# EAGLE design LED_board (2) (EAGLE 9.6.2)
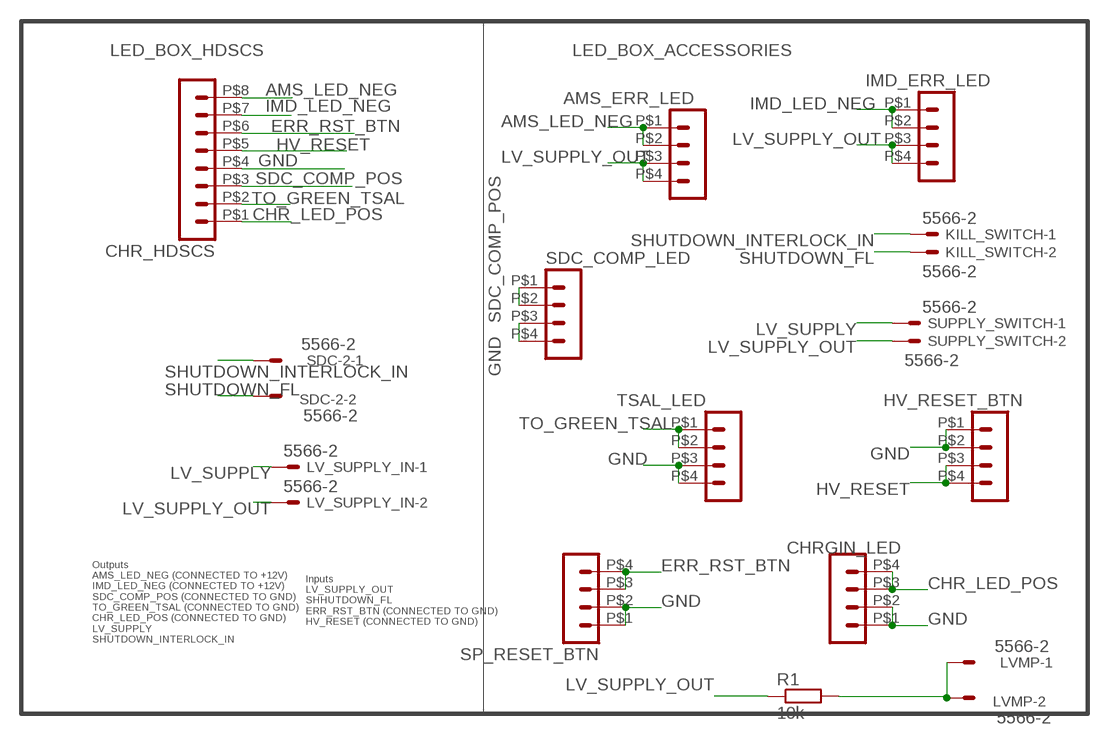
[diagram p0: schematic, sheet 1]

## Parts
AMS_ERR_LED  HEADER_POS4_43045-0412  [43045-0412]
CHR_HDSCS  HEADER_POS8_44914-0801  [44914-0801]
CHRGIN_LED  HEADER_POS4_43045-0412  [43045-0412]
HV_RESET_BTN  HEADER_POS4_43045-0412  [43045-0412]
IMD_ERR_LED  HEADER_POS4_43045-0412  [43045-0412]
KILL_SWITCH  5566-2  [5566-2]
LV_SUPPLY_IN  5566-2  [5566-2]
LVMP  5566-2  [5566-2]
R1  10k  R-EU_M0805  [M0805]
SDC-2  5566-2  [5566-2]
SDC_COMP_LED  HEADER_POS4_44914-0401  [44914-0401]
SP_RESET_BTN  HEADER_POS4_43045-0412  [43045-0412]
SUPPLY_SWITCH  5566-2  [5566-2]
TSAL_LED  HEADER_POS4_43045-0412  [43045-0412]

## Nets
AMS_LED_NEG: AMS_ERR_LED.P$1 AMS_ERR_LED.P$2 CHR_HDSCS.P$8
CHR_LED_POS: CHR_HDSCS.P$1 CHRGIN_LED.P$3 CHRGIN_LED.P$4
ERR_RST_BTN: CHR_HDSCS.P$6 SP_RESET_BTN.P$3 SP_RESET_BTN.P$4
GND: CHR_HDSCS.P$4 CHRGIN_LED.P$1 CHRGIN_LED.P$2 HV_RESET_BTN.P$1 HV_RESET_BTN.P$2 SDC_COMP_LED.P$3 SDC_COMP_LED.P$4 SP_RESET_BTN.P$1 SP_RESET_BTN.P$2 TSAL_LED.P$3 TSAL_LED.P$4
HV_RESET: CHR_HDSCS.P$5 HV_RESET_BTN.P$3 HV_RESET_BTN.P$4
IMD_LED_NEG: CHR_HDSCS.P$7 IMD_ERR_LED.P$1 IMD_ERR_LED.P$2
LV_SUPPLY: LV_SUPPLY_IN.1 SUPPLY_SWITCH.1
LV_SUPPLY_OUT: AMS_ERR_LED.P$3 AMS_ERR_LED.P$4 IMD_ERR_LED.P$3 IMD_ERR_LED.P$4 LV_SUPPLY_IN.2 R1.1 SUPPLY_SWITCH.2
N$1: LVMP.1 LVMP.2 R1.2
SDC_COMP_POS: CHR_HDSCS.P$3 SDC_COMP_LED.P$1 SDC_COMP_LED.P$2
SHUTDOWN_FL: KILL_SWITCH.2 SDC-2.2
SHUTDOWN_INTERLOCK_IN: KILL_SWITCH.1 SDC-2.1
TO_GREEN_TSAL: CHR_HDSCS.P$2 TSAL_LED.P$1 TSAL_LED.P$2

## Notes on the sheet
- LED_BOX_HDSCS | LED_BOX_ACCESSORIES
- Inputs
  LV_SUPPLY_OUT
  SHHUTDOWN_FL
  ERR_RST_BTN (CONNECTED TO GND)
  HV_RESET (CONNECTED TO GND)
- Outputs
  AMS_LED_NEG (CONNECTED TO +12V)
  IMD_LED_NEG (CONNECTED TO +12V)
  SDC_COMP_POS (CONNECTED TO GND)
  TO_GREEN_TSAL (CONNECTED TO GND)
  CHR_LED_POS (CONNECTED TO GND)
  LV_SUPPLY
  SHUTDOWN_INTERLOCK_IN

## Library data of the parts
AMS_ERR_LED CHRGIN_LED HV_RESET_BTN IMD_ERR_LED SP_RESET_BTN TSAL_LED = IIT_BOMBAY_Racing2 (1):HEADER_POS4_?: Molex - Micro-Fit 3.0 Series connector, 3.00mm (0.118") pitch header, 4 positions.
CHR_HDSCS = IIT_BOMBAY_Racing:HEADER_POS8_?: Molex - Micro-Fit 3.0 Series connector, 3.00mm (0.118") pitch header, 8 positions.
KILL_SWITCH LV_SUPPLY_IN LVMP SDC-2 SUPPLY_SWITCH = con-molex:5566-2: Mini FIT connector 2 pol Source: http://www.molex.com; MF: MOLEX; OC_FARNELL: 1822072; OC_NEWARK: unknown
R1 = IIT_BOMBAY_Racing:R-EU_: RESISTOR, European symbol
SDC_COMP_LED = IIT_BOMBAY_Racing:HEADER_POS4_?: Molex - Micro-Fit 3.0 Series connector, 3.00mm (0.118") pitch header, 4 positions.

## Net classes
0 default: width 0.127 mm, drill 0.127 mm, clearance 0.127 mm

## Board
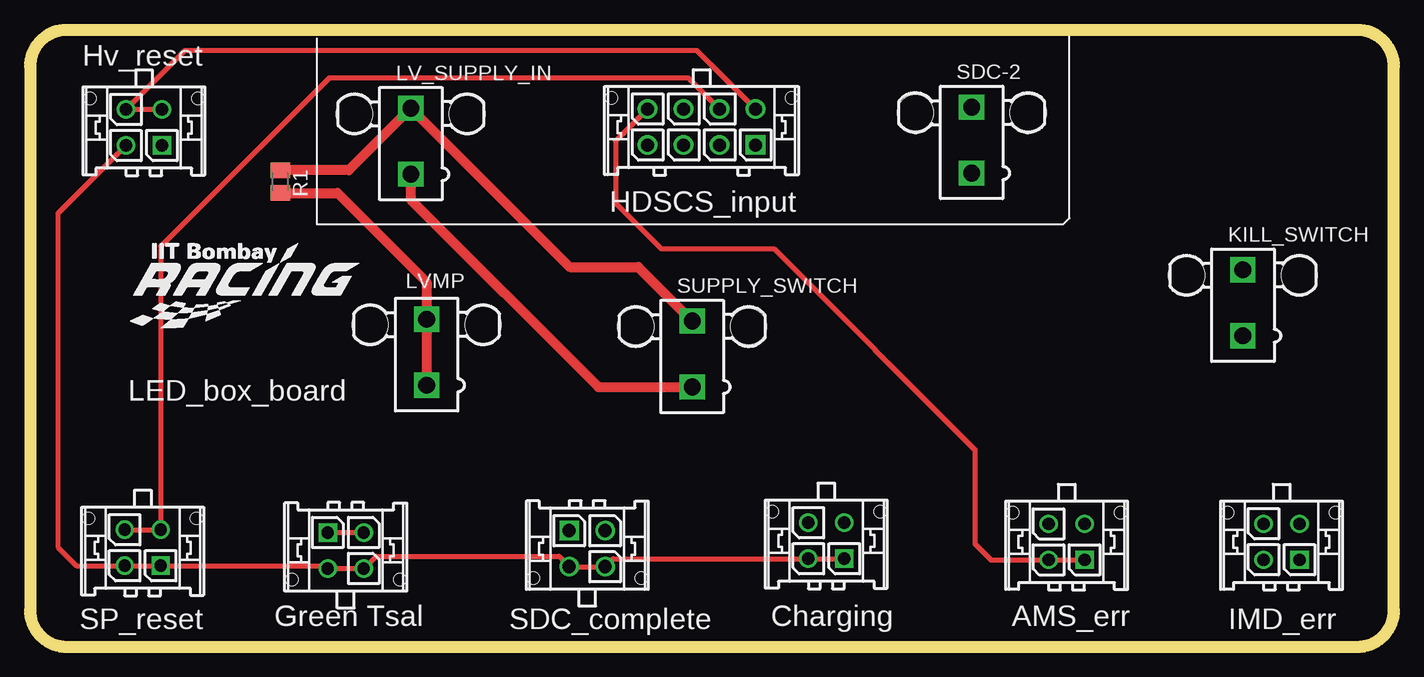
[diagram p1: board, top side]
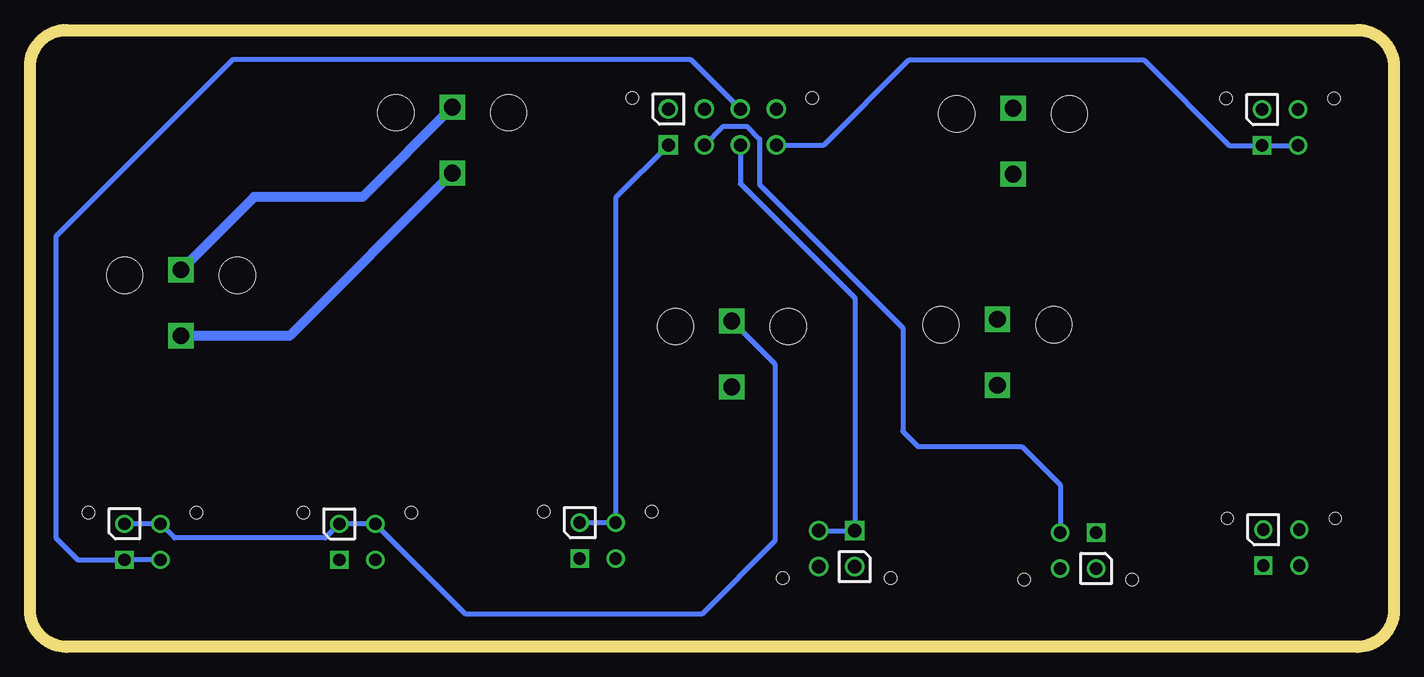
[diagram p2: board, bottom side, seen from below]

Size 113.7 x 51.44 mm. Coordinates in mm from the lower left corner, seen from the top.
Outline: 3.05,0 110.66,0 arc90 113.7,3.05 113.7,48.39 arc90 110.66,51.44 3.05,51.44 arc90 0,48.39 0,3.05 arc90 3.05,0
Copper layers (1*16): Top 0.035mm / dielectric 1.5mm / Bottom 0.035mm
Design rules "PCB_Power": minimum track width 5mil, minimum drill 10mil, track to track 5mil, track to pad 5mil, pad to pad 5mil, via to via 5mil, smd to smd 5mil, copper to edge 10mil, drill to drill 6mil, minimum pad ring 5mil, minimum via ring 5mil, stop-mask expansion 3mil, vias tented up to drill 0mil, thermal gap 10mil

### Footprints (pad centres in the part's own frame; a part is rotated, then mirrored left to right if it is on the bottom)
43045-0412 = drill 1.02 square: P$1 1.5,0 | drill 1.02: P$2 -1.5,0; P$3 1.5,3; P$4 -1.5,3 | hole 1.02: 4.5,3.94; -4.5,3.94
44914-0801 = drill 1.09 square: P$1 4.5,0 | drill 1.09: P$2 1.5,0; P$3 -1.5,0; P$4 -4.5,0; P$5 4.5,3; P$6 1.5,3; P$7 -1.5,3; P$8 -4.5,3 | hole 1.02: 7.5,3.94; -7.5,3.94
5566-2 = drill 1.4 square: 1 0,-2.75; 2 0,2.75 | hole 3: 4.7,2.29; -4.7,2.29
M0805 = smd 1.3 x 1.6: 1 -0.95,0; 2 0.95,0
44914-0401 = drill 1.09 square: P$1 1.5,0 | drill 1.09: P$2 -1.5,0; P$3 1.5,3; P$4 -1.5,3 | hole 1.02: 4.5,3.94; -4.5,3.94

### Placement (x,y rotation side)
AMS_ERR_LED  86.41,7.25 0 top
CHR_HDSCS  55.98,41.84 0 top
CHRGIN_LED  66.38,7.35 0 top
HV_RESET_BTN  9.49,41.81 0 top
IMD_ERR_LED  104.33,7.25 0 top
KILL_SWITCH  101.11,28.69 0 top
LV_SUPPLY_IN  31.75,42.15 0 top
LVMP  33.06,24.56 0 top
R1  20.87,38.79 270 top
SDC-2  78.5,42.26 0 top
SDC_COMP_LED  46.45,9.69 180 top
SP_RESET_BTN  9.39,6.77 0 top
SUPPLY_SWITCH  55.2,24.42 0 top
TSAL_LED  26.32,9.53 180 top
U$5  [RACING_LOGO_290MIL]  8.01,26.29 0 top

### Tracks (layer width: path | path; a pad name or v marks a point on that pad's centre or on a via)
AMS_LED_NEG
  Top 0.406: CHR_HDSCS.P$8 48.81,42.17 48.81,37.01 52.62,33.2 62.02,33.2 78.78,16.44 78.78,8.56 80.1,7.25 AMS_ERR_LED.P$2 AMS_ERR_LED.P$1
CHR_LED_POS
  Bottom 0.406: CHR_HDSCS.P$1 64.88,37.44 CHRGIN_LED.P$4 CHRGIN_LED.P$3
ERR_RST_BTN
  Top 0.406: CHR_HDSCS.P$6 54.9,47.42 24.93,47.42 10.89,33.39 SP_RESET_BTN.P$3 SP_RESET_BTN.P$4
GND
  Top 0.406: HV_RESET_BTN.P$2 2.33,36.14 2.33,8.31 3.87,6.77 SP_RESET_BTN.P$2 SP_RESET_BTN.P$1 24.58,6.77 TSAL_LED.P$3 TSAL_LED.P$4 28.84,7.55 44.09,7.55 SDC_COMP_LED.P$3 SDC_COMP_LED.P$4 48.61,7.35 CHRGIN_LED.P$2 CHRGIN_LED.P$1
  Bottom 0.406: CHR_HDSCS.P$4 47.53,41.84 40.43,48.95 20.87,48.95 13.73,41.81 HV_RESET_BTN.P$1 HV_RESET_BTN.P$2
HV_RESET
  Top 0.406: CHR_HDSCS.P$5 55.62,49.71 12.9,49.71 HV_RESET_BTN.P$4 HV_RESET_BTN.P$3
IMD_LED_NEG
  Bottom 0.406: CHR_HDSCS.P$7 58.59,48.95 96.81,48.95 111.55,34.22 111.55,9.07 109.73,7.25 IMD_ERR_LED.P$1 IMD_ERR_LED.P$2
LV_SUPPLY
  Top 0.813: LV_SUPPLY_IN.1 31.75,37.3 47.39,21.67 SUPPLY_SWITCH.1
LV_SUPPLY_OUT
  Top 0.813: SUPPLY_SWITCH.2 50.69,31.68 44.98,31.68 LV_SUPPLY_IN.2 26.58,39.74 R1.1
  Bottom 0.406: SUPPLY_SWITCH.2 51.6,23.56 51.6,8.82 57.7,2.72 77.39,2.72 AMS_ERR_LED.P$4 AMS_ERR_LED.P$3 89.09,9.07 101.65,9.07 IMD_ERR_LED.P$4 IMD_ERR_LED.P$3
N$1
  Top 0.813: R1.2 25.63,37.84 33.06,30.41 LVMP.2 LVMP.1
SDC_COMP_POS
  Bottom 0.406: CHR_HDSCS.P$3 54.48,38.62 44.95,29.09 SDC_COMP_LED.P$1 SDC_COMP_LED.P$2
SHUTDOWN_FL
  Bottom 0.813: SDC-2.2 85.99,37.52 95.03,37.52 KILL_SWITCH.2
SHUTDOWN_INTERLOCK_IN
  Bottom 0.813: SDC-2.1 92.07,25.94 KILL_SWITCH.1
TO_GREEN_TSAL
  Top 0.406: TSAL_LED.P$1 TSAL_LED.P$2
  Bottom 0.406: TSAL_LED.P$2 27.82,13.49 31.03,16.69 39.66,16.69 40.93,17.96 40.93,26.6 52.87,38.53 52.87,42.34 53.89,43.36 55.97,43.36 CHR_HDSCS.P$2

### Text on the board
tNames: Hv_reset | HDSCS_input | LED_box_board | SP_reset | Green Tsal | SDC_complete | Charging | AMS_err | IMD_err